# Altium schematic sheet esp12e_adaptor.SchDoc
size A4
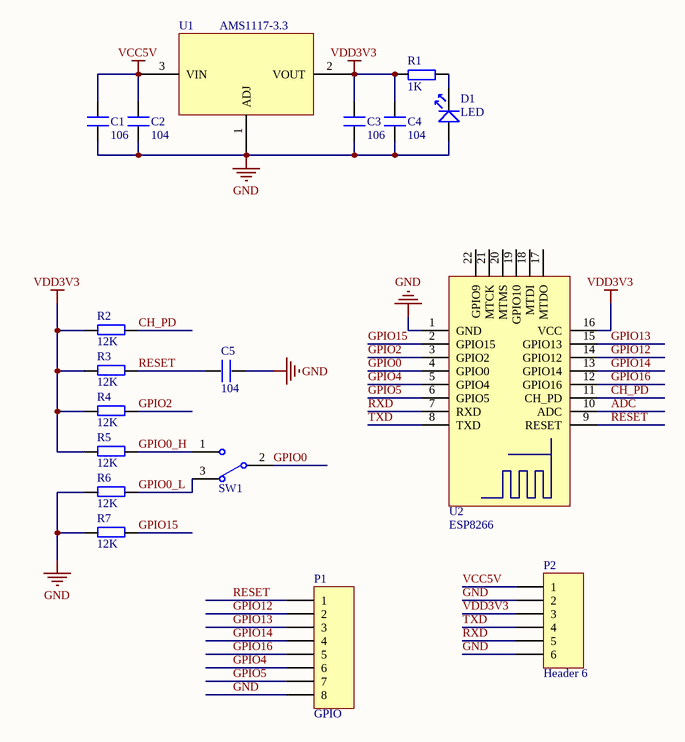
[diagram p0: esp12e_adaptor.SchDoc]

## Parts
C1  106  [0603P]
C2  104  [0603P]
C3  106  [0603P]
C4  104  [0603P]
C5  104  [0603P]
D1  LED  [SMDLED]
P1  GPIO  [HDR1X8]
P2  Header 6  [HDR1X6]
R1  1K  [0603P]
R2  12K  [0603P]
R3  12K  [0603P]
R4  12K  [0603P]
R5  12K  [0603P]
R6  12K  [0603P]
R7  12K  [0603P]
SW1  SW-SPDT  [HDR1X3]  (value not drawn)
U1  AMS1117-3.3  [SOT223_L]
U2  ESP8266  [ESP8266]

## Nets
GND: C1.1 C2.1 C3.1 C4.1 C5.2 D1.1 P1.8 P2.2 P2.6 R6.2 R7.2 U1.1(ADJ) U2.1(GND)
VCC5V: C1.2 C2.2 P2.1 U1.3(VIN)
VDD3V3: C3.2 C4.2 P2.3 R1.1 R2.2 R3.2 R4.2 R5.2 U1.2(VOUT) U2.16(VCC)
ADC: U2.10(ADC)
CH_PD: R2.1 U2.11(CH_PD)
GPIO0: SW1.2 U2.4(GPIO0)
GPIO0_H: R5.1 SW1.1
GPIO0_L: R6.1 SW1.3
GPIO2: R4.1 U2.3(GPIO2)
GPIO4: P1.6 U2.5(GPIO4)
GPIO5: P1.7 U2.6(GPIO5)
GPIO12: P1.2 U2.14(GPIO12)
GPIO13: P1.3 U2.15(GPIO13)
GPIO14: P1.4 U2.13(GPIO14)
GPIO15: R7.1 U2.2(GPIO15)
GPIO16: P1.5 U2.12(GPIO16)
RESET: C5.1 P1.1 R3.1 U2.9(RESET)
RXD: P2.5 U2.7(RXD)
TXD: P2.4 U2.8(TXD)
NetD1_2: D1.2 R1.2

Not connected (* = marked no-connect by the designer): U2 17(MTDO) 18(MTDI) 19(GPIO10) 20(MTMS) 21(MTCK) 22(GPIO9)

## Library data of the parts
C1-C5 = C
P1 = Header 8: Header, 8-Pin; LatestRevisionDate: 17-Jul-2002; LatestRevisionNote: Re-released for DXP Platform.; Publisher: Altium Limited
P2 = Header 6: Header, 6-Pin; LatestRevisionDate: 17-Jul-2002; LatestRevisionNote: Re-released for DXP Platform.; Publisher: Altium Limited
R1-R7 = R